# EAGLE design pam2803-boost-driver-17mm-mk-1.0 (EAGLE 6.6.0)
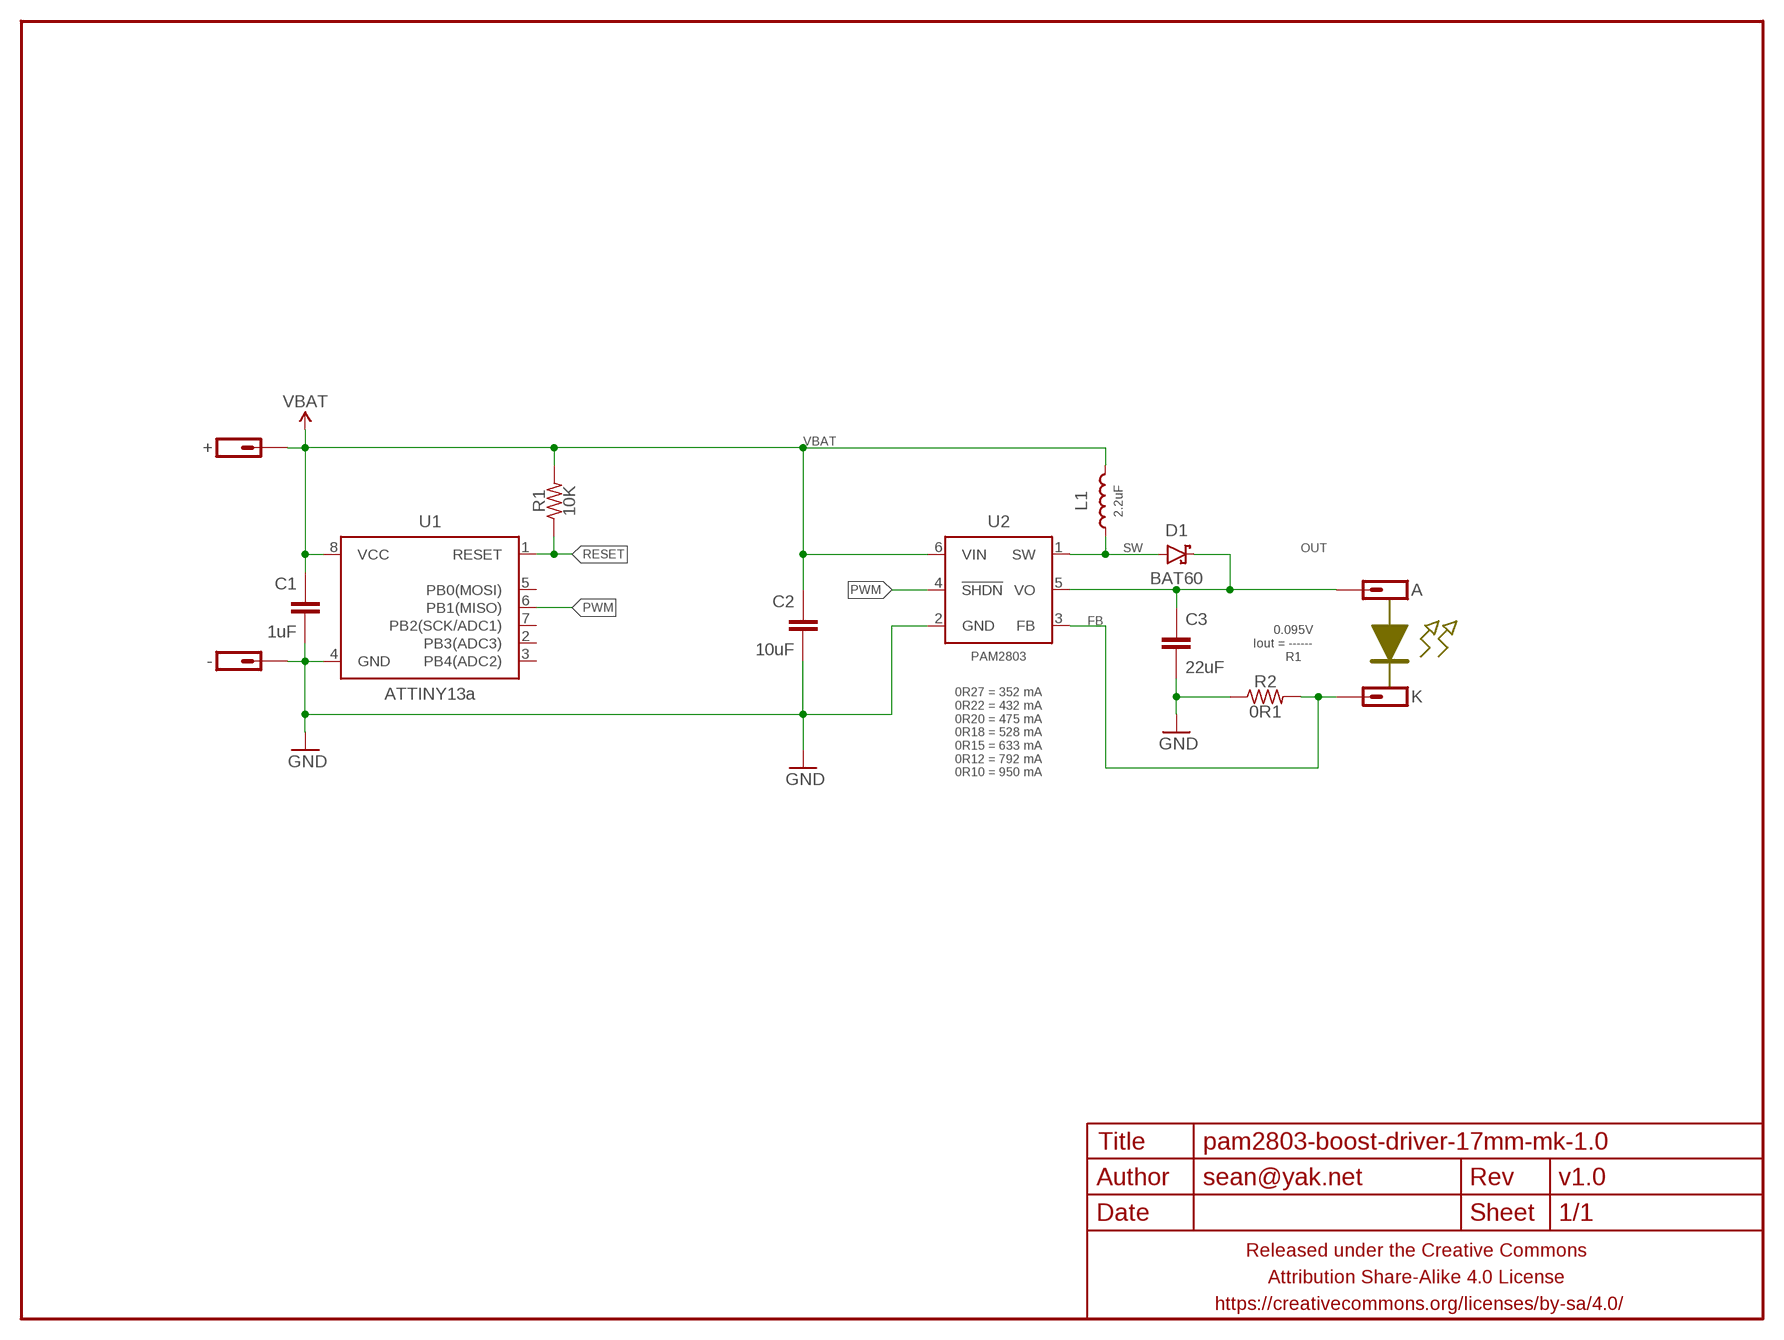
[diagram p0: schematic, sheet 1]

## Parts
+  M01PTH-1MM-CIR-NS  [1X01-1MM-CIR-NS]
-  M01NOT-A-VIA-NOPE  [1X01_NOSILK_NOSTOP]
A  M01SMD-1.75DIA  [1X01-SMD-1.75DIA]
C1  1uF  CAPACITOR-CERAMICC0603-TIGHTER  [C0603-TIGHTER]
C2  10uF  CAPACITOR-CERAMICC0805-TIGHTER  [C0805-TIGHTER]
C3  22uF  CAPACITOR-CERAMICC0805-TIGHTER  [C0805-TIGHTER]
D1  BAT60  DIODE-SCHOTTKYSOD323  [SOD323-SCHOTTKY]
FRAME1  FRAME-LETTERNO_PACKAGE  [DUMMY]
K  M01SMD-1.75DIA  [1X01-SMD-1.75DIA]
L1  2.2uF  INDUCTORXFL4020  [XFL4020]
R1  10K  RESISTORR0603-TIGHTER  [R0603-TIGHTER]
R2  0R1  RESISTORR0805-TIGHTER  [R0805-TIGHTER]
U1  ATTINY13a  ATTINY13SOIC-NARROWER  [SO08-SKINNYPADS]
U2  PAM2803  PAM2803SOT23-6  [SOT23-6]

## Nets
FB: K.P$1 R2.2 U2.3(FB)
GND: -.P$1 C1.2 C2.2 C3.2 R2.1 U1.4(GND) U2.2(GND)
OUT: A.P$1 C3.1 D1.C U2.5(VO)
PWM: U1.6(PB1(MISO)) U2.4(!SHDN)
RESET: R1.1 U1.1(RESET)
SW: D1.A L1.P$2 U2.1(SW)
VBAT: +.1 C1.1 C2.1 L1.P$1 R1.2 U1.8(VCC) U2.6(VIN)
Unconnected: U1.2(PB3(ADC3)) U1.3(PB4(ADC2)) U1.5(PB0(MOSI)) U1.7(PB2(SCK/ADC1))

## Notes on the sheet
- 0.095V
  Iout = ------
        R1
- 0R27 = 352 mA
  0R22 = 432 mA
  0R20 = 475 mA
  0R18 = 528 mA
  0R15 = 633 mA
  0R12 = 792 mA
  0R10 = 950 mA

## Library data of the parts
+ - A K = a_parts:M01: Header 1 Standard 1-pin 0.1" header. Use with straight break away headers (SKU : PRT-00116), right angle break away headers (PRT-00553), swiss pins (PRT-00743), machine pins (PRT-00117), and female headers (PRT-00115).
C1-C3 = a_parts:CAPACITOR-CERAMIC: CAPACITOR, European symbol
D1 = a_parts:DIODE-SCHOTTKY: Schottky diodes in SFE's production catalog BAT20J 1A 23V 0.62Vf RB751 120mA 40V 0.37Vf PMEG4005EJ 0.5A 40V 0.42Vf MBRA140 1A 40V 0.5Vf B340A 3A 40V SMA
FRAME1 = a_parts:FRAME-LETTER: Schematic Frame Standard 8.5x11 US Letter frame; DESIGNER: sean@yak.net; VERSION: v1.0
L1 = a_parts:INDUCTOR: Inductors Basic Inductor/Choke - 0603 and 1206. Footprints are not proven and vary greatly between part numbers. SRN6045- 33uH, 20% 1.4A SDR0403-560KL - 56uH, 10%, 500mA RMS/740mA peak
R1 R2 = a_parts:RESISTOR: RESISTOR, American symbol
U1 = a_parts:ATTINY13: Atmel 8-pin 1kB flash uC
U2 = a_parts:PAM2803

## Board
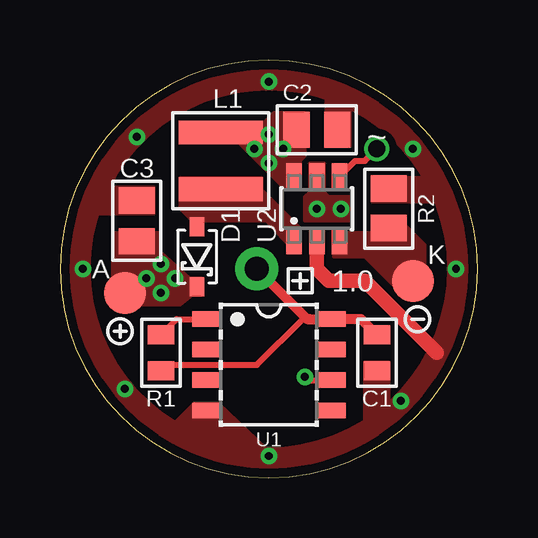
[diagram p1: board, top side]
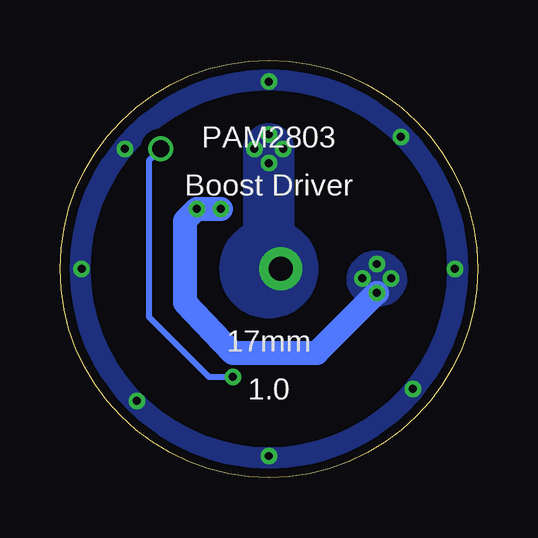
[diagram p2: board, bottom side, seen from below]

Size 17.4 x 17.4 mm. Coordinates in mm from the lower left corner, seen from the top.
Outline: 0,8.7 arc180 17.4,8.7 arc180 0,8.7
Copper layers (1*16): Top 0.0356mm / dielectric 1.5011mm / Bottom 0.0356mm
Design rules "LaenPCBOrder2": minimum track width 6mil, minimum drill 13mil, track to track 6mil, track to pad 6mil, pad to pad 6mil, via to via 6mil, smd to smd 6mil, copper to edge 15mil, drill to drill 6mil, minimum pad ring 7mil, minimum via ring 7mil, stop-mask expansion 3mil, vias tented up to drill 20mil, thermal gap 10mil

### Footprints (pad centres in the part's own frame; a part is rotated, then mirrored left to right if it is on the bottom)
1X01-1MM-CIR-NS = drill 1.016 pad 1.778: 1 0,0
1X01_NOSILK_NOSTOP = drill 0.33: P$1 0,0
1X01-SMD-1.75DIA = smd 1.75 x 1.75: P$1 0,0
C0603-TIGHTER = smd 0.8 x 1.1: 1 -0.75,0; 2 0.75,0
C0805-TIGHTER = smd 1.1 x 1.5: 1 -0.85,0; 2 0.85,0
SOD323-SCHOTTKY = smd 0.8 x 0.6: A -1.25,0; C 1.25,0
XFL4020 = smd 0.98 x 3.5: P$1 -1.185,0; P$2 1.185,0
R0603-TIGHTER = smd 0.8 x 1.1: 1 -0.75,0; 2 0.75,0
R0805-TIGHTER = smd 1.1 x 1.5: 1 -0.85,0; 2 0.8,0
SO08-SKINNYPADS = smd 0.65 x 1.2: 1 -1.905,-2.6; 2 -0.635,-2.6; 3 0.635,-2.6; 4 1.905,-2.6; 5 1.905,2.6; 6 0.635,2.6; 7 -0.635,2.6; 8 -1.905,2.6
SOT23-6 = smd 0.65 x 1.1: 1 -0.95,-1.35; 2 0,-1.35; 3 0.95,-1.35; 4 0.95,1.35; 5 0,1.35; 6 -0.95,1.35

### Placement (x,y rotation side)
+  8.2,8.7 0 top
-  0.95,8.7 90 top
A  2.7,7.7 180 top
C1  13.2,5.2 270 top
C2  10.7,14.5 0 top
C3  3.2,10.7 90 top
D1  5.7,9.2 270 top
FRAME1  0.2,0.2 0 top
K  14.7,8.2 0 top
L1  6.7,13.2 270 top
R1  4.2,5.2 270 top
R2  13.7,11.2 270 top
U1  8.7,4.7 270 top
U2  10.7,11.2 0 top

### Tracks (layer width: path | path; a pad name or v marks a point on that pad's centre or on a via)
FB
  pour Top (rank 2, no thermals): 11.4,10.2 11.4,9.2 12.7,9.2 14.2,7.7 15.2,7.7 15.2,9.7 14.2,10.7 13.1,10.7 13.1,10.2
GND  (via drill 0.33)
  Top 0.6: U2.2 10.7,8.7 11.2,8.2 12.7,8.2 15.7,5.2
  other vias: 16.5,8.7 8.7,16.5 3.2,14.2 8.7,0.9 2.7,3.7 14.2,3.2 14.7,13.7
  pour Bottom (isolate 0.305, rank 6, no thermals): 0.2,8.7 arc-90 8.7,17.2 arc-90 17.2,8.7 16.2,8.7 arc90 8.7,16.2 arc90 1.2,8.7
  pour Bottom (isolate 0.305, rank 6, no thermals): 17.2,8.7 arc-90 8.7,0.2 arc-90 0.2,8.7 1.2,8.7 arc90 8.7,1.2 arc90 16.2,8.7
  pour Top (isolate 0.305, rank 6, no thermals): 0.2,8.7 arc-90 8.7,17.2 arc-90 17.2,8.7 16.2,8.7 arc90 8.7,16.2 arc90 1.2,8.7
  pour Top (isolate 0.305, rank 6, no thermals): 17.2,8.7 arc-90 8.7,0.2 arc-90 0.2,8.7 1.2,8.7 arc90 8.7,1.2 arc90 16.2,8.7
  pour Top (rank 2, no thermals): 5.6,3.1 6.6,3.1 8.6,1.2 8.7,1.1 8.7,0.7 7.7,0.7 4.7,2.2
  pour Top (rank 2, no thermals): 12.7,4.8 12.7,2.2 13.2,2.2 13.7,2.7 13.7,4.8
  pour Top (rank 2, no thermals): 1.7,12.1 3.9,12.1 3.9,11 1.2,11
  pour Top (rank 2, no thermals): 11.1,16 12.1,16 12.1,13.8 11.1,13.8
  pour Top (rank 2, no thermals): 13,11.5 13,12.5 15.7,12.5 15.7,11.5
OUT  (via drill 0.33)
  Bottom 1: v4.2,7.7 6.7,5.2 10.2,5.2 12.2,7.3 12.2,10.7 v11.7,11.2 v10.7,11.2
  other vias: 3.6,8.3 4.2,8.9 4.8,8.3
  pour Top (rank 2, no thermals): 10.4,13.1 11,13.1 11,11.9 11.2,11.7 12.2,11.7 12.2,10.7 10.2,10.7 10.2,11.7 10.4,11.9
  pour Top (rank 2, no thermals): 2.2,7.2 5,7.2 5.5,7.6 5.9,7.6 5.9,8.3 5.4,8.3 4.2,9.4 4.2,10.2 2.2,10.2
  pour Bottom (rank 2, no thermals): 3,8.2 arc90 4.2,7.2 arc90 5.4,8.2 arc90 4.2,9.4 arc90
PWM  (via drill 0.33, 0.7)
  Top 0.25: U2.4 12.3,13.2 12.7,13.2 v13.2,13.7 | v10.2,4.2 10.33,4.06 U1.6
  Bottom 0.25: v13.2,13.7 13.7,13.2 13.7,6.7 11.2,4.2 v10.2,4.2
RESET
  Top 0.25: R1.1 4.86,6.6 U1.1
SW
  pour Top (rank 2, no thermals): 5,12.5 8.4,12.5 8.4,12 10,10.4 10,9.4 9.5,9.4 9.5,9.7 8.6,10.7 5.5,10.7 5,11.2
VBAT  (via drill 0.33)
  Top 0.25: R1.2 4.45,4.7 8.2,4.7 10.1,6.6 10.4,6.6
  Top 0.406: +.1 10.29,6.6 10.4,6.6 U1.8 12.54,6.6 C1.1
  other vias: 8.1,13.7 8.7,13.1 9.3,13.7 8.7,14.3
  pour Bottom (rank 2, no thermals): 6.7,8.7 arc-90 8.7,10.7 arc-90 10.7,8.7 arc-90 8.7,6.7 arc-90
  pour Top (rank 2, no thermals): 5.1,14.8 8.5,14.8 8.9,15.2 10.2,15.2 10.2,13.4 10,13.2 10,12.1 9.3,12.1 7.4,14 5.1,14
  pour Bottom (rank 2, no thermals): 7.7,8.2 9.7,8.2 9.7,13.7 arc90 8.7,14.7 arc90 7.7,13.7

### Text on the board
bPlace: PAM2803 | Boost Driver | 17mm
tNames: ~